# Altium schematic sheet LoRa.SchDoc
size A3; PageSetup: Record=PageOptions|CenterHorizontal=True|CenterVertical=True|PrintScale=0.65|XCorrection=1.00|YCorrection=1.00|PrintKind=1|BorderSize=5000000|LeftOffset=0|BottomOffset=0|Orientation=2|PaperLength=1000|PaperWidth=1000|Scale=100|PaperSource=15|PrintQuality=300|MediaType=1|DitherType=10|PrintScaleMode=1|PaperKind=A4|PaperIndex=9
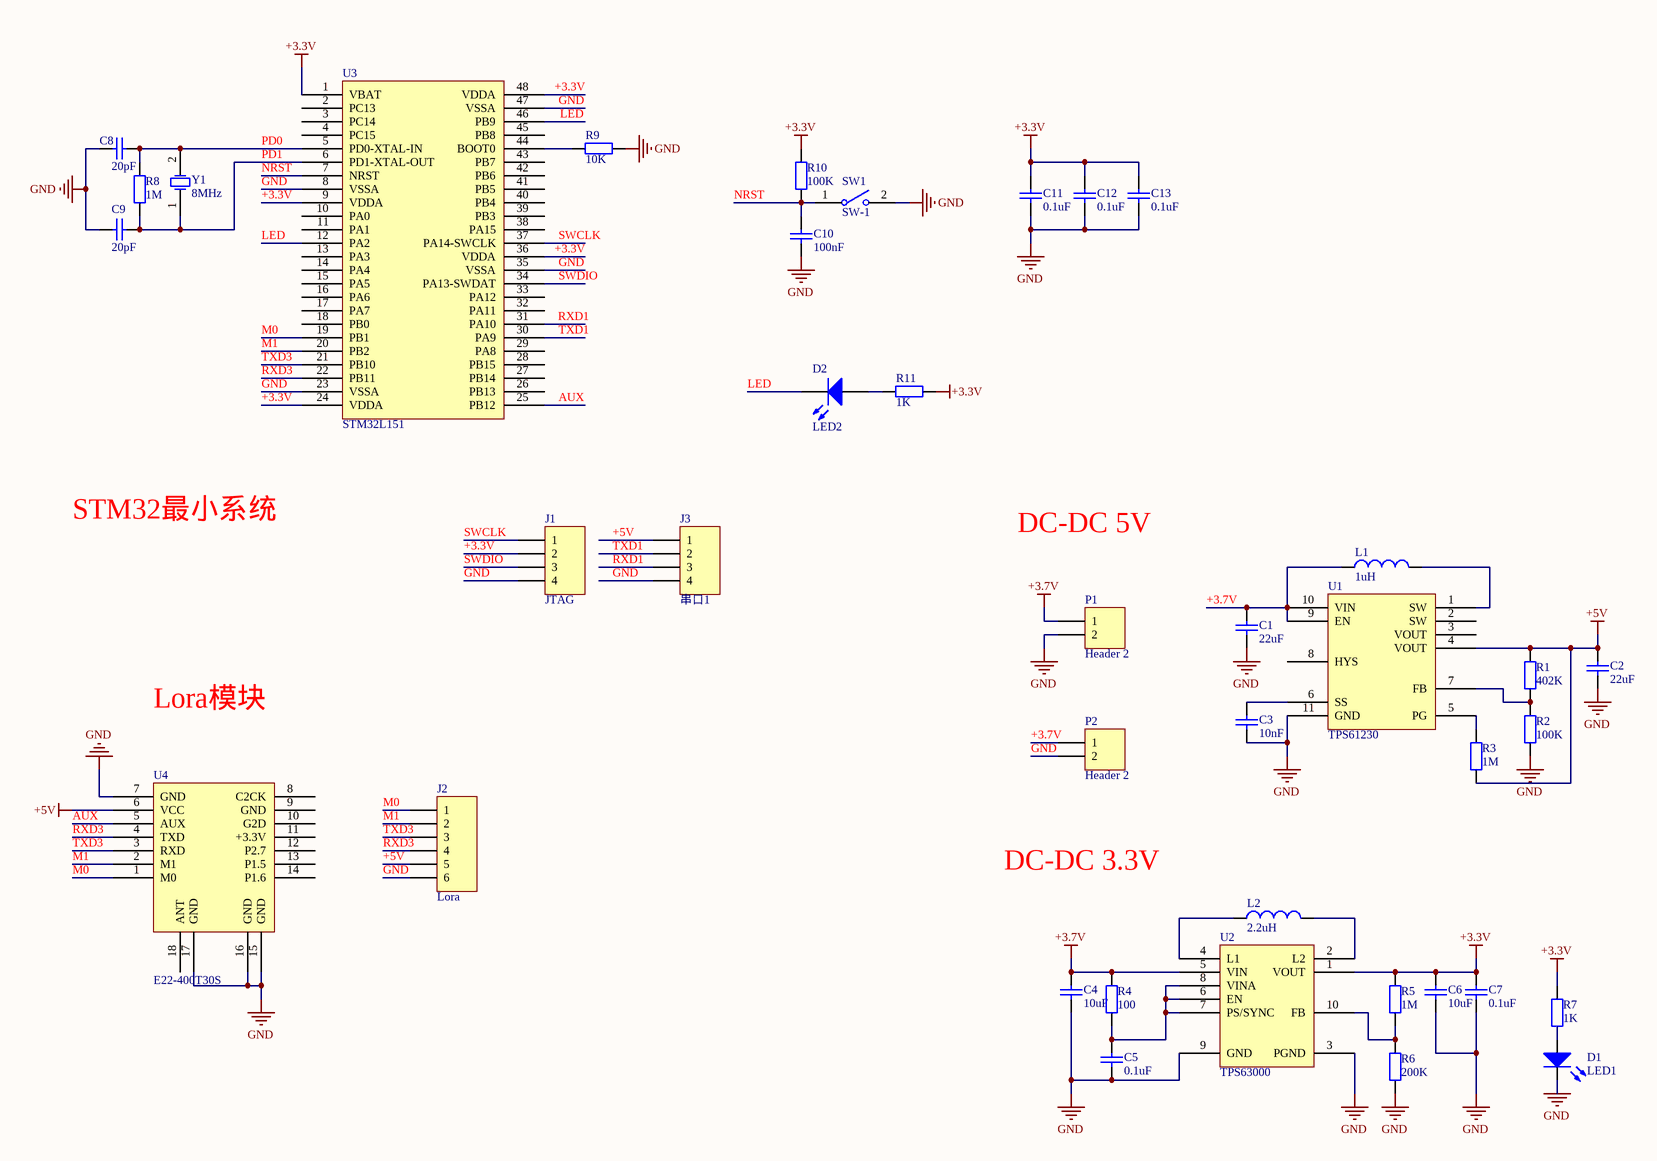
[diagram p0: LoRa.SchDoc]

## Parts
C1  value 22uF  [0603C]  (hidden comment: Cap1)
C2  value 22uF  [0603C]  (hidden comment: Cap2)
C3  value 10nF  [0603C]  (hidden comment: Cap3)
C4  value 10uF  [0603C]  (hidden comment: Cap4)
C5  value 0.1uF  [0603C]  (hidden comment: Cap5)
C6  value 10uF  [0603C]  (hidden comment: Cap6)
C7  value 0.1uF  [0603C]  (hidden comment: Cap7)
C8  value 20pF  [0603C]  (hidden comment: Cap8)
C9  value 20pF  [0603C]  (hidden comment: Cap9)
C10  value 100nF  [0603C]  (hidden comment: Cap10)
C11  value 0.1uF  [0603C]  (hidden comment: Cap11)
C12  value 0.1uF  [0603C]  (hidden comment: Cap12)
C13  value 0.1uF  [0603C]  (hidden comment: Cap13)
D1  LED1  [贴片二极管]
D2  LED2  [贴片二极管]
J1  JTAG  [HDR1X4]
J2  Lora  [HDR1X6]
J3  串口1  [HDR1X4]
L1  value 1uH  [IND-SMD_L4.0-W4.0_SMNR4020]  (hidden comment: Inductor1)
L2  value 2.2uH  [IND-SMD_L4.0-W4.0_SMNR4020]  (hidden comment: Inductor2)
P1  Header 2  [HDR1X2]
P2  Header 2  [HDR1X2]
R1  value 402K  [0603R]  (hidden comment: Res1)
R2  value 100K  [0603R]  (hidden comment: Res2)
R3  value 1M  [0603R]  (hidden comment: Res3)
R4  value 100  [0603R]  (hidden comment: Res4)
R5  value 1M  [0603R]  (hidden comment: Res5)
R6  value 200K  [0603R]  (hidden comment: Res6)
R7  value 1K  [0603R]  (hidden comment: Res7)
R8  value 1M  [0603R]  (hidden comment: Res8)
R9  value 10K  [0603R]  (hidden comment: Res9)
R10  value 100K  [0603R]  (hidden comment: Res10)
R11  value 1K  [0603R]  (hidden comment: Res11)
SW1  SW-1  [SW-1]
U1  TPS61230  [VSON-10_L3.0-W3.0-P0.50-BL-EP]
U2  TPS63000  [SON-10_L3.1-W3.1-P0.50-BL-EP]
U3  STM32L151  [TQFP48]
U4  E22-400T30S  [PE32(915T30S)]
Y1  8MHz  [XTAL]

## Nets
+3.3V: C6.2 C7.2 C11.1 C12.1 C13.1 J1.2 R5.2 R7.2 R10.2 R11.2 U2.1(VOUT) U3.1(VBAT) U3.9(VDDA) U3.24(VDDA) U3.36(VDDA) U3.48(VDDA)
+3.7V: C1.2 C4.2 L1.1 P1.1 P2.1 R4.2 U1.9(EN) U1.10(VIN) U2.5(VIN)
+5V: C2.2 J2.5 J3.1 R1.2 R3.1 U1.4(VOUT) U4.6(VCC)
GND: C1.1 C2.1 C3.1 C4.1 C5.1 C6.1 C7.1 C8.2 C9.2 C10.2 C11.2 C12.2 C13.2 D1.2(K) J1.4 J2.6 J3.4 P1.2 P2.2 R2.1 R6.1 R9.2 SW1.2(COMMON) U1.11(GND) U2.3(PGND) U2.9(GND) U3.8(VSSA) U3.23(VSSA) U3.35(VSSA) U3.47(VSSA) U4.7(GND) U4.15(GND) U4.16(GND) U4.17(GND)
AUX: U3.25(PB12) U4.5(AUX)
LED: D2.2(K) U3.12(PA2) U3.46(PB9)
M0: J2.1 U3.19(PB1) U4.1(M0)
M1: J2.2 U3.20(PB2) U4.2(M1)
NRST: C10.1 R10.1 SW1.1(COMMON) U3.7(NRST)
PD0: C8.1 R8.2 U3.5(PD0-XTAL-IN) Y1.2(OSC2)
PD1: C9.1 R8.1 U3.6(PD1-XTAL-OUT) Y1.1(OSC1)
RXD1: J3.3 U3.31(PA10)
RXD3: J2.4 U3.22(PB11) U4.4(TXD)
SWCLK: J1.1 U3.37(PA14-SWCLK)
SWDIO: J1.3 U3.34(PA13-SWDAT)
TXD1: J3.2 U3.30(PA9)
TXD3: J2.3 U3.21(PB10) U4.3(RXD)
NetC3_2: C3.2 U1.6(SS)
NetC5_2: C5.2 R4.1 U2.6(EN) U2.7(PS/SYNC) U2.8(VINA)
NetD1_1: D1.1(A) R7.1
NetD2_1: D2.1(A) R11.1
NetL1_2: L1.2 U1.1(SW)
NetL2_1: L2.1 U2.4(L1)
NetL2_2: L2.2 U2.2(L2)
NetR1_1: R1.1 R2.2 U1.7(FB)
NetR3_2: R3.2 U1.5(PG)
NetR5_1: R5.1 R6.2 U2.10(FB)
NetR9_1: R9.1 U3.44(BOOT0)

Not connected (* = marked no-connect by the designer): U1 2(SW) 3(VOUT) 8(HYS); U3 2(PC13) 3(PC14) 4(PC15) 10(PA0) 11(PA1) 13(PA3) 14(PA4) 15(PA5) 16(PA6) 17(PA7) 18(PB0) 26(PB13) 27(PB14) 28(PB15) 29(PA8) 32(PA11) 33(PA12) 38(PA15) 39(PB3) 40(PB4) 41(PB5) 42(PB6) 43(PB7) 45(PB8); U4 8(C2CK) 9(GND) 10(G2D) 11(+3.3V) 12(P2.7) 13(P1.5) 14(P1.6) 18(ANT)

## Notes on the sheet
- STM32最小系统
- DC-DC 5V
- Lora模块
- DC-DC 3.3V

## Library data of the parts
C1-C13 = Cap: Capacitor; Published: 8-Jun-2000; LatestRevisionDate: 17-Jul-2002; LatestRevisionNote: Re-released for DXP Platform.; PackageReference: RAD-0.3; Publisher: Altium Limited; PackageDescription: Radial Cap, Thru-Hole; 2 Leads; 0.3 in Pin Spacing
D1 D2 = LED1: Typical RED GaAs LED; Published: 8-Jun-2000; LatestRevisionDate: 08-Jul-2005; LatestRevisionNote: Mech Layer 1 removed.; PackageReference: LED-1; Publisher: Altium Limited; PackageDescription: LED; 2 Leads
J1 J3 = Header 4: Header, 4-Pin; LatestRevisionDate: 17-Jul-2002; LatestRevisionNote: Re-released for DXP Platform.; Publisher: Altium Limited
J2 = Header 6: Header, 6-Pin; LatestRevisionDate: 17-Jul-2002; LatestRevisionNote: Re-released for DXP Platform.; Publisher: Altium Limited
L1 L2 = Inductor: Code_IEC: 1005; Published: 8-Jun-2000; LatestRevisionDate: 29-May-2009; LatestRevisionNote: IPC-7351 Footprint Added.; PackageReference: 0402-A; Publisher: Altium Limited; PackageDescription: Chip Inductor; Code_JEITA: 0402
P1 P2 = Header 2: Header, 2-Pin; LatestRevisionDate: 17-Jul-2002; LatestRevisionNote: Re-released for DXP Platform.; Publisher: Altium Limited
R1-R11 = Res2: Resistor; Published: 8-Jun-2000; LatestRevisionDate: 17-Jul-2002; LatestRevisionNote: Re-released for DXP Platform.; PackageReference: AXIAL-0.4; Publisher: Altium Limited; PackageDescription: Axial Device, Thru-Hole; 2 Leads; 0.4 in Pin Spacing
Y1 = XTAL: Crystal Oscillator; Published: 8-Jun-2000; LatestRevisionDate: 17-Jul-2002; LatestRevisionNote: Re-released for DXP Platform.; PackageReference: R38; Publisher: Altium Limited; PackageDescription: Crystal, Thru-Hole; 2 Leads; Body 3.1 x 8.2 mm (Dia.xH)